# Altium schematic sheet Power Management.SchDoc
size A4
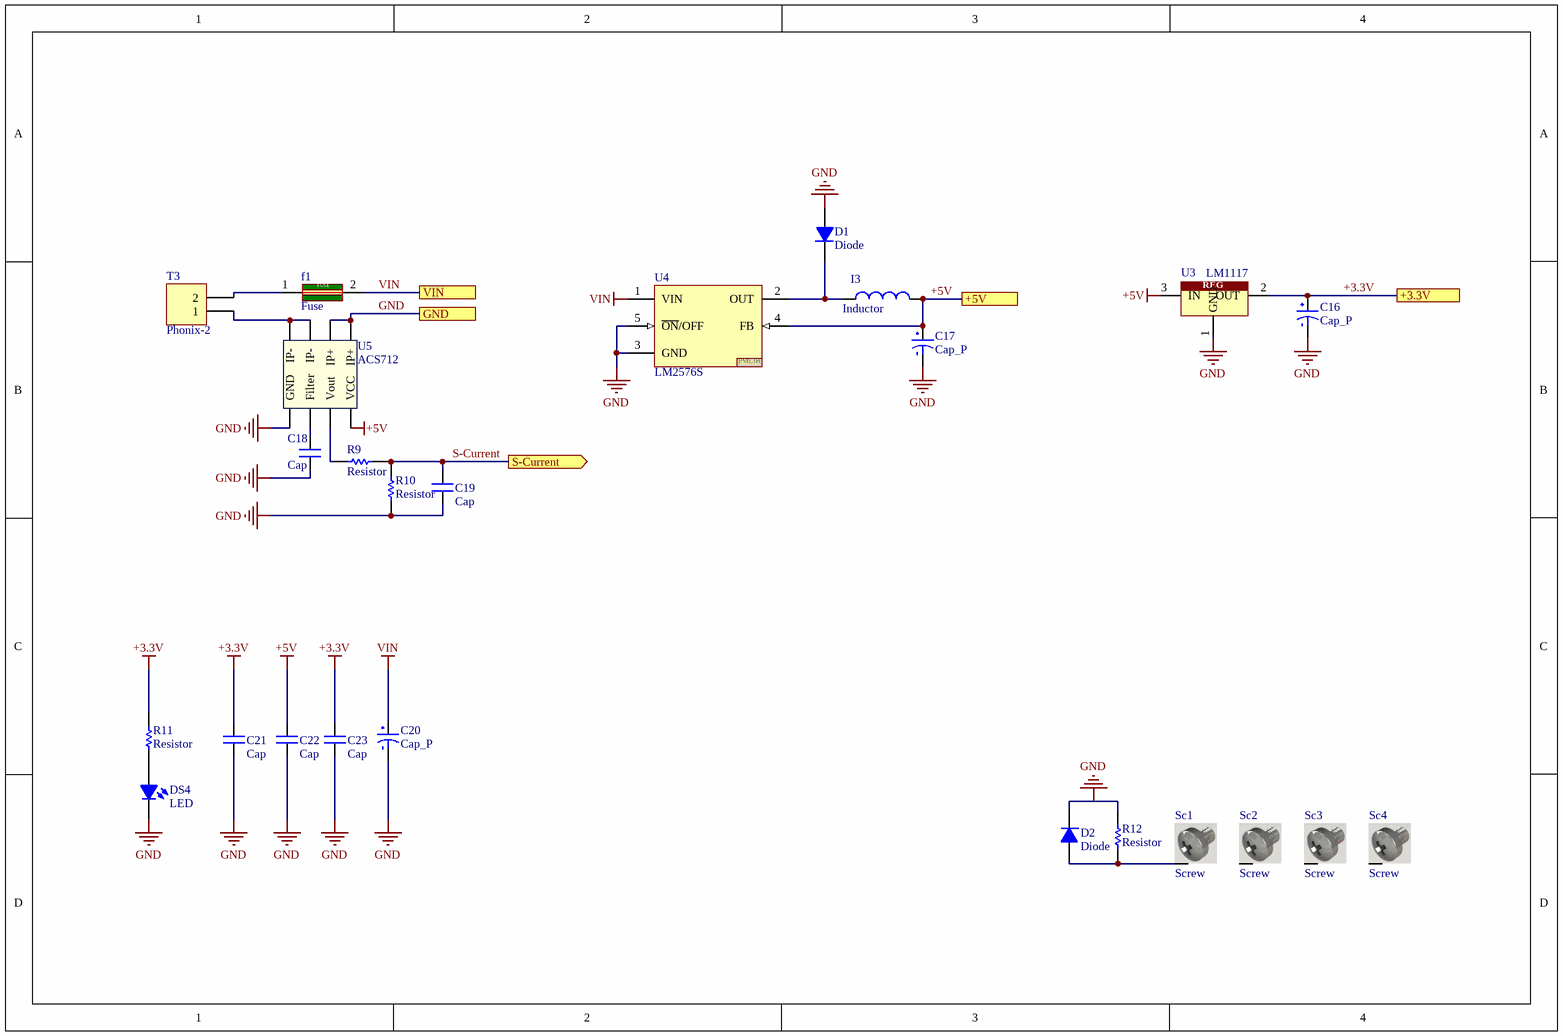
[diagram p0: Power Management.SchDoc]

## Parts
C16  Cap_P  [Cap_4mm]
C17  Cap_P  [Cap_4mm]
C18  Cap  [Cap0805]
C19  Cap  [Cap0805]
C20  Cap_P  [Cap_5mm]
C21  Cap  [Cap0805]
C22  Cap  [Cap0805]
C23  Cap  [Cap0805]
D1  Diode  [Diod-1A-SMD]
D2  Diode  [Diod-1A-SMD]
DS4  LED  [Led0805]
f1  Fuse  [1206]
I3  Inductor  [Indicator_SMD]
R9  Resistor  [R0805]
R10  Resistor  [R0805]
R11  Resistor  [R0805]
R12  Resistor  [0603]
Sc1  Screw  [Screw]
Sc2  Screw  [Screw]
Sc3  Screw  [Screw]
Sc4  Screw  [Screw]
T3  Phonix-2  [Phonix-2]
U3  LM1117  [DPACK]
U4  LM2576S  [LM2576S]
U5  ACS712  [SOP8]

## Ports
+3.3V, +5V, GND, S-Current (out), VIN

## Nets
+3.3V: C16.2 C21.2 C23.2 R11.1 U3.2(OUT) ; port +3.3V
+5V: C17.2 C22.2 I3.2 U3.3(IN) U4.4(FB) U5.8(VCC) ; port +5V
GND: C16.1 C17.1 C18.1 C19.1 C20.1 C21.1 C22.1 C23.1 D1.A D2.K DS4.K R10.2 R12.1 U3.1(GND) U4.3(GND) U4.5(~{ON}/OFF) U5.1(IP+) U5.2(IP+) U5.5(GND) ; port GND
VIN: C20.2 f1.2(OUT) U4.1(VIN) ; port VIN
S-Current: C19.2 R9.1 R10.1 ; port S-Current
NetC18_2: C18.2 U5.6(Filter)
NetD1_K: D1.K I3.1 U4.2(OUT)
NetD2_A: D2.A R12.2 Sc1.S
NetDS4_A: DS4.A R11.2
Netf1_1: f1.1(IN) T3.2
NetR9_2: R9.2 U5.7(Vout)
NetT3_1: T3.1 U5.3(IP-) U5.4(IP-)

Not connected (* = marked no-connect by the designer): Sc2 S; Sc3 S; Sc4 S

## Notes on the sheet
- Title
- Size:
- Data:
- CompanyName:
- A4
- Number:
- Time:
- Revision:
- Engineer:
- File:
- (in symbol Fuse) FUSE
- (in symbol LM1117) REG
- (in symbol LM2576S) PMLIB

## Library data of the parts
C16 C17 C20 = Cap_P: Polarity
C18 C19 C21-C23 = Cap: Surface mount Capacitor
I3 = Inductor: Indicator
Sc1-Sc4 = Screw: Screw 3mm
T3 = Phonix-2: Connector
U3 = LM1117: Regulator
U4 = LM2576S: Regulator
U5 = ACS712: Hall effect Current Sensor